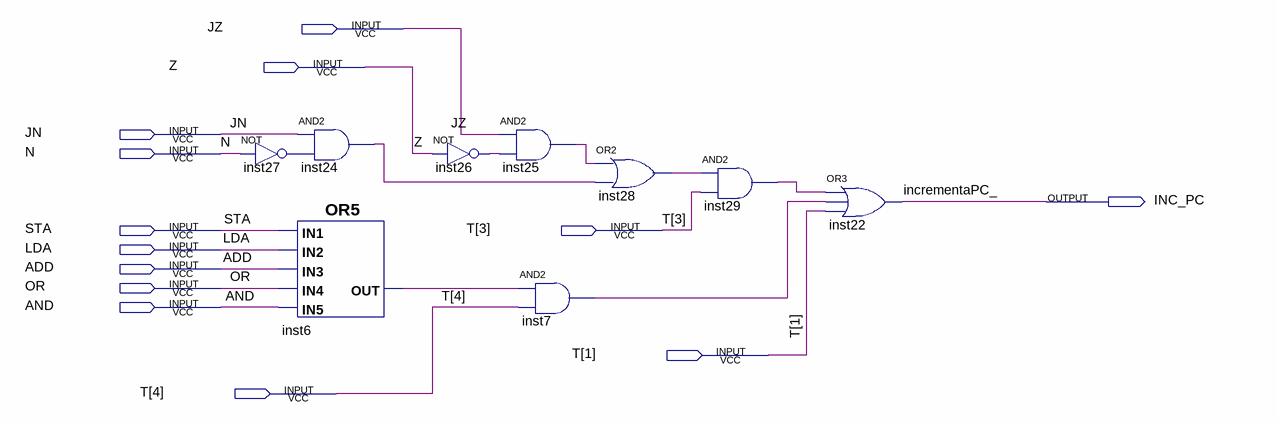
[diagram p0: schematic sheet]
// Quartus schematic UNIDADE_CONTROLE_INCC_PC.bdf as structural Verilog: 9 symbols, 13 pins
module UNIDADE_CONTROLE_INCC_PC (
  input  JZ,
  input  Z,
  input  JN,
  input  N,
  input  STA,
  input  [4:1] T,
  input  LDA,
  input  ADD,
  input  OR,
  input  AND,
  output INC_PC
);

  wire inst6_out, inst7_out, inst24_out, inst25_out, inst26_out, inst27_out, inst28_out, inst29_out;

  not inst27 (inst27_out, N);
  and inst24 (inst24_out, JN, inst27_out);
  or inst6 (inst6_out, STA, LDA, ADD, OR, AND);
  not inst26 (inst26_out, Z);
  and inst25 (inst25_out, JZ, inst26_out);
  and inst7 (inst7_out, inst6_out, T[4]);
  or inst28 (inst28_out, inst25_out, inst24_out);
  and inst29 (inst29_out, inst28_out, T[3]);
  or inst22 (INC_PC, inst29_out, inst7_out, T[1]);

  // Other names for the same wires on the sheet: incrementaPC_ = INC_PC
endmodule
